# Altium schematic sheet micro.SchDoc
size A4
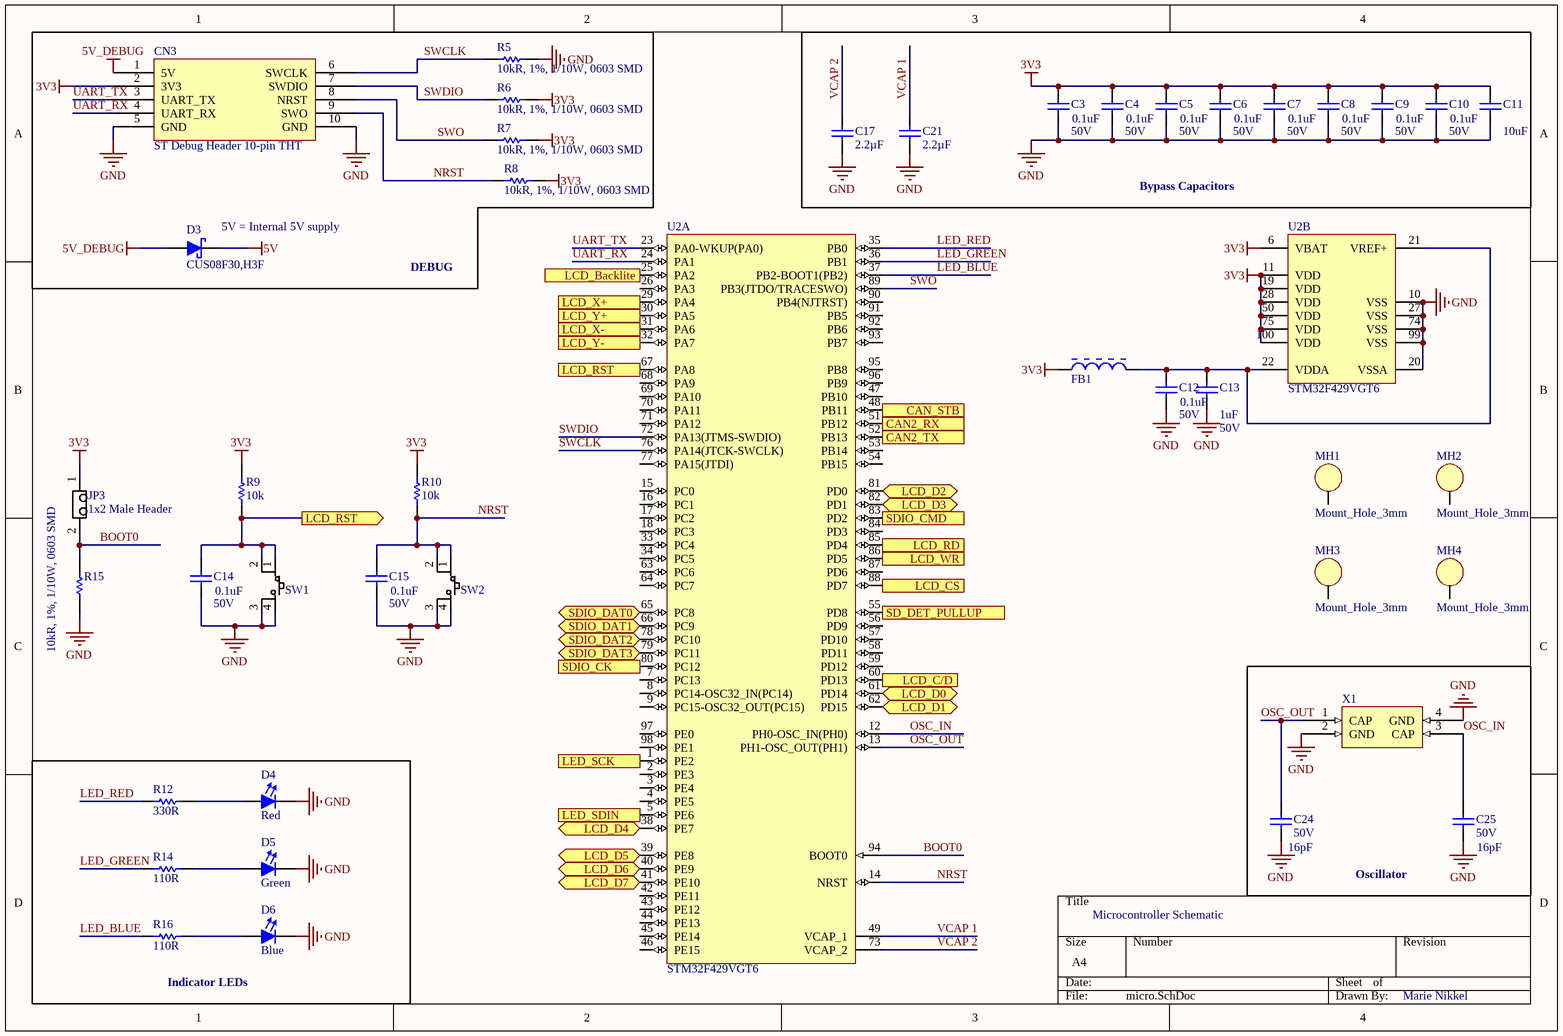
[diagram p0: micro.SchDoc]

## Parts
C3  Voltage: 50V  Capacitance: 0.1uF  [FP-CL10-0_1-IPC_A]  (hidden comment: CL10B104JB8NNNC)
C4  Voltage: 50V  Capacitance: 0.1uF  [FP-CL10-0_1-IPC_A]  (hidden comment: CL10B104JB8NNNC)
C5  Voltage: 50V  Capacitance: 0.1uF  [FP-CL10-0_1-IPC_A]  (hidden comment: CL10B104JB8NNNC)
C6  Voltage: 50V  Capacitance: 0.1uF  [FP-CL10-0_1-IPC_A]  (hidden comment: CL10B104JB8NNNC)
C7  Voltage: 50V  Capacitance: 0.1uF  [FP-CL10-0_1-IPC_A]  (hidden comment: CL10B104JB8NNNC)
C8  Voltage: 50V  Capacitance: 0.1uF  [FP-CL10-0_1-IPC_A]  (hidden comment: CL10B104JB8NNNC)
C9  Voltage: 50V  Capacitance: 0.1uF  [FP-CL10-0_1-IPC_A]  (hidden comment: CL10B104JB8NNNC)
C10  Voltage: 50V  Capacitance: 0.1uF  [FP-CL10-0_1-IPC_A]  (hidden comment: CL10B104JB8NNNC)
C11  Capacitance: 10uF  [CAPC3216X180X50ML20T30]  (hidden comment: CL31B106KBHNNNE)
C12  Voltage: 50V  Capacitance: 0.1uF  [FP-CL10-0_1-IPC_A]  (hidden comment: CL10B104JB8NNNC)
C13  Capacitance: 1uF  Voltage: 50V  [0803 CAP]  (hidden comment: CL21B105KBFNNNG)
C14  Voltage: 50V  Capacitance: 0.1uF  [FP-CL10-0_1-IPC_A]  (hidden comment: CL10B104JB8NNNC)
C15  Voltage: 50V  Capacitance: 0.1uF  [FP-CL10-0_1-IPC_A]  (hidden comment: CL10B104JB8NNNC)
C17  value 2.2µF  [CAPC1608N(0603")]  (hidden comment: 2.2uF, 50V, 0603 SMD, X5R, Ceramic)
C21  value 2.2µF  [CAPC1608N(0603")]  (hidden comment: 2.2uF, 50V, 0603 SMD, X5R, Ceramic)
C24  Voltage: 50V  Capacitance: 16pF  [CAPC1608X90X35ML10T15]  (hidden comment: 16pF Ceramic 50V 5% 0603)
C25  Voltage: 50V  Capacitance: 16pF  [CAPC1608X90X35ML10T15]  (hidden comment: 16pF Ceramic 50V 5% 0603)
CN3  ST Debug Header 10-pin THT  [10-pin shrouded header THT]
D3  CUS08F30,H3F  [SC-76]
D4  Color: Red  [FP-LB_Q39E-MFG]  (hidden comment: LSQ976-NR-1)
D5  Color: Green  [FP-LB_Q39E-MFG]  (hidden comment: LT Q39G-Q1OO-25-1)
D6  Color: Blue  [FP-LB_Q39E-MFG]  (hidden comment: LBQ39E-N1OO-35-1)
FB1  BLM18AG601SN1D  [MURA-BLM18-F-H1-CHIP-2_V]  (value not drawn)
JP3  1x2 Male Header  [2X1 Males Header]
MH1  Mount_Hole_3mm  [Mount-Hole_3mm]
MH2  Mount_Hole_3mm  [Mount-Hole_3mm]
MH3  Mount_Hole_3mm  [Mount-Hole_3mm]
MH4  Mount_Hole_3mm  [Mount-Hole_3mm]
R5  10kR, 1%, 1/10W, 0603 SMD  [RESC1608N(0603")]
R6  10kR, 1%, 1/10W, 0603 SMD  [RESC1608N(0603")]
R7  10kR, 1%, 1/10W, 0603 SMD  [RESC1608N(0603")]
R8  10kR, 1%, 1/10W, 0603 SMD  [RESC1608N(0603")]
R9  value 10k  [RESC1608N(0603")]  (hidden comment: 10kR, 1%, 1/10W, 0603 SMD)
R10  value 10k  [RESC1608N(0603")]  (hidden comment: 10kR, 1%, 1/10W, 0603 SMD)
R12  Resistance: 330R  [FP-CRCW0603-e3-IPC_C]  (hidden comment: CRCW0603330RFKEA)
R14  Resistance: 110R  [RESC1608X55X25ML10T15]  (hidden comment: RC0603FR-07110RL)
R15  10kR, 1%, 1/10W, 0603 SMD  [RESC1608N(0603")]
R16  Resistance: 110R  [RESC1608X55X25ML10T15]  (hidden comment: RC0603FR-07110RL)
SW1  PTS645SL43SMTR92LFS  [4-SPST-NO]  (value not drawn)
SW2  PTS645SL43SMTR92LFS  [4-SPST-NO]  (value not drawn)
U2  STM32F429VGT6  [STM-LQFP100_L]  (parts A,B of 2)
X1  CRYSTAL 8.0MHZ 16PF SMD  [QFN250P750X520X140_HS-5M]  (value not drawn)

## Blocks framed on the sheet
Bypass Capacitors: C3-C11 C17 C21
Oscillator: C24 C25 X1
Indicator LEDs: D4-D6 R12 R14 R16

## Ports
CAN2_RX (in), CAN2_TX (out), CAN_STB (out), LCD_Backlite (out), LCD_C/D (out), LCD_CS (out), LCD_D0 (bidir), LCD_D1 (bidir), LCD_D2 (bidir), LCD_D3 (bidir), LCD_D4 (bidir), LCD_D5 (bidir), LCD_D6 (bidir), LCD_D7 (bidir), LCD_RD (out), LCD_RST (out), LCD_WR (out), LCD_X+ (in), LCD_X- (in), LCD_Y+ (in), LCD_Y- (in), LED_SCK (out), LED_SDIN (out), SD_DET_PULLUP (out), SDIO_CK (out), SDIO_CMD (out), SDIO_DAT0 (bidir), SDIO_DAT1 (bidir), SDIO_DAT2 (bidir), SDIO_DAT3 (bidir)

## Nets
3V3: C3.2 C4.2 C5.2 C6.2 C7.2 C8.2 C9.2 C10.2 C11.2 CN3.2(3V3) FB1.1 JP3.1 R6.2 R7.2 R8.2 R9.2 R10.2 U2.6(VBAT) U2.11(VDD) U2.19(VDD) U2.28(VDD) U2.50(VDD) U2.75(VDD) U2.100(VDD)
5V: D3.K(Cathode)
5V_DEBUG: CN3.1(5V) D3.A(Anode)
GND: C3.1 C4.1 C5.1 C6.1 C7.1 C8.1 C9.1 C10.1 C11.1 C12.1 C13.1 C14.1 C15.1 C17.1(Anode) C21.1(Anode) C24.1 C25.1 CN3.5(GND) CN3.10(GND) D4.1(Cathode) D5.1(Cathode) D6.1(Cathode) R5.2 R15.1 SW1.3 SW1.4 SW2.3 SW2.4 U2.10(VSS) U2.20(VSSA) U2.27(VSS) U2.74(VSS) U2.99(VSS) X1.2(GND) X1.4(GND)
BOOT0: JP3.2 R15.2 U2.94(BOOT0)
CAN2_RX: U2.51(PB12) ; port CAN2_RX
CAN2_TX: U2.52(PB13) ; port CAN2_TX
CAN_STB: U2.48(PB11) ; port CAN_STB
LCD_Backlite: U2.25(PA2) ; port LCD_Backlite
LCD_C/D: U2.60(PD13) ; port LCD_C/D
LCD_CS: U2.88(PD7) ; port LCD_CS
LCD_D0: U2.61(PD14) ; port LCD_D0
LCD_D1: U2.62(PD15) ; port LCD_D1
LCD_D2: U2.81(PD0) ; port LCD_D2
LCD_D3: U2.82(PD1) ; port LCD_D3
LCD_D4: U2.38(PE7) ; port LCD_D4
LCD_D5: U2.39(PE8) ; port LCD_D5
LCD_D6: U2.40(PE9) ; port LCD_D6
LCD_D7: U2.41(PE10) ; port LCD_D7
LCD_RD: U2.85(PD4) ; port LCD_RD
LCD_RST: C14.2 R9.1 SW1.1 SW1.2 U2.67(PA8) ; port LCD_RST
LCD_WR: U2.86(PD5) ; port LCD_WR
LCD_X+: U2.29(PA4) ; port LCD_X+
LCD_X-: U2.31(PA6) ; port LCD_X-
LCD_Y+: U2.30(PA5) ; port LCD_Y+
LCD_Y-: U2.32(PA7) ; port LCD_Y-
LED_BLUE: R16.1 U2.37(PB2-BOOT1(PB2))
LED_GREEN: R14.1 U2.36(PB1)
LED_RED: R12.1 U2.35(PB0)
LED_SCK: U2.1(PE2) ; port LED_SCK
LED_SDIN: U2.5(PE6) ; port LED_SDIN
NRST: C15.2 CN3.9(SWO) R8.1 R10.1 SW2.1 SW2.2 U2.14(NRST)
OSC_IN: C25.2 U2.12(PH0-OSC_IN(PH0)) X1.3(CAP)
OSC_OUT: C24.2 U2.13(PH1-OSC_OUT(PH1)) X1.1(CAP)
SD_DET_PULLUP: U2.55(PD8) ; port SD_DET_PULLUP
SDIO_CK: U2.80(PC12) ; port SDIO_CK
SDIO_CMD: U2.83(PD2) ; port SDIO_CMD
SDIO_DAT0: U2.65(PC8) ; port SDIO_DAT0
SDIO_DAT1: U2.66(PC9) ; port SDIO_DAT1
SDIO_DAT2: U2.78(PC10) ; port SDIO_DAT2
SDIO_DAT3: U2.79(PC11) ; port SDIO_DAT3
SWCLK: CN3.6(SWCLK) R5.1 U2.76(PA14(JTCK-SWCLK))
SWDIO: CN3.7(SWDIO) R6.1 U2.72(PA13(JTMS-SWDIO))
SWO: CN3.8(NRST) R7.1 U2.89(PB3(JTDO/TRACESWO))
UART_RX: CN3.4(UART_RX) U2.24(PA1)
UART_TX: CN3.3(UART_TX) U2.23(PA0-WKUP(PA0))
VCAP 1: C21.2(Cathode) U2.49(VCAP_1)
VCAP 2: C17.2(Cathode) U2.73(VCAP_2)
NetC12_2: C12.2 C13.2 FB1.2 U2.21(VREF+) U2.22(VDDA)
NetD4_2: D4.2(Anode) R12.2
NetD5_2: D5.2(Anode) R14.2
NetD6_2: D6.2(Anode) R16.2

Not connected (* = marked no-connect by the designer): MH1 1; MH2 1; MH3 1; MH4 1; U2 2(PE3) 3(PE4) 4(PE5) 7(PC13) 8(PC14-OSC32_IN(PC14)) 9(PC15-OSC32_OUT(PC15)) 15(PC0) 16(PC1) 17(PC2) 18(PC3) 26(PA3) 33(PC4) 34(PC5) 42(PE11) 43(PE12) 44(PE13) 45(PE14) 46(PE15) 47(PB10) 53(PB14) 54(PB15) 56(PD9) 57(PD10) 58(PD11) 59(PD12) 63(PC6) 64(PC7) 68(PA9) 69(PA10) 70(PA11) 71(PA12) 77(PA15(JTDI)) 84(PD3) 87(PD6) 90(PB4(NJTRST)) 91(PB5) 92(PB6) 93(PB7) 95(PB8) 96(PB9) 97(PE0) 98(PE1)

## Notes on the sheet
- (near D3) 5V = Internal 5V supply
- DEBUG
- Microcontroller Schematic
- Marie Nikkel

## Library data of the parts
C3 = CMP-00000-4: CAP CER 0.1UF 50V X7R 0603; Tolerance: 5%; Material: Ceramic; Case Code (Imperial): 0603; Mount: Surface Mount; Thickness: 0.035inch; Depth: 0.8mm; Packaging: Tape and Reel; Package Quantity: 1; Dielectric: X7R; Height: 0.8mm; Radiation Hardening: No; Max Operating Temperature: 125°C; Voltage Rating: 50V; Case/Package: 0603; Min Operating Temperature: -55°C; Case Code (Metric): 1608; Length: 1.6mm; Contact Plating: Tin; Width: 0.031inch
C4-C10 C12 C14 C15 = CMP-00000-3: CAP CER 0.1UF 50V X7R 0603; Tolerance: 5%; Material: Ceramic; Case Code (Imperial): 0603; Mount: Surface Mount; Thickness: 0.035inch; Depth: 0.8mm; Packaging: Tape and Reel; Package Quantity: 1; Dielectric: X7R; Height: 0.8mm; Radiation Hardening: No; Max Operating Temperature: 125°C; Voltage Rating: 50V; Case/Package: 0603; Min Operating Temperature: -55°C; Case Code (Metric): 1608; Length: 1.6mm; Contact Plating: Tin; Width: 0.031inch
C11 = CMP-00004-1: Cap Ceramic 10uF 50V X7R 10% Pad SMD 1206 125°C T/R; Thickness: 0.071inch; Case/Package: 1206; Case Code (Metric): 3216; Case Code (Imperial): 1206; Voltage Rating: 50V; Length: 0.126inch; Max Operating Temperature: 125°C; Voltage Rating (DC): 50V; Dielectric: X7R; Lead Free: Lead Free; Min Operating Temperature: -55°C; Tolerance: 10%; Mount: Surface Mount; Packaging: Tape and Reel; Width: 0.063inch
C13 = CMP-00005-3: SAMSUNG ELECTRO-MECHANICS - CL21B105KBFNNNG - MLCC CAPACITORS; Tolerance: 10%; Material: Ceramic; Dielectric: X7R; Case/Package: 0805; Voltage Rating: 50V; Contact Plating: Tin; Max Operating Temperature: 125°C; Termination: Wraparound; Package Quantity: 3000; Depth: 1.25mm; Mount: Surface Mount; Min Operating Temperature: -55°C; Thickness: 0.053inch; Packaging: Tape and Reel; Case Code (Metric): 2012; Length: 2mm; Case Code (Imperial): 0805; Width: 0.049inch
C17 C21 = CMP-006-0030-1: Capacitor, Ceramic, 50V, 10%, 0603 SMD, X5R; Date Created: *; Design Item ID: 2.2uF, 50V, 0603 SMD, X5R, Ceramic; Made By: *; Publisher: AUVic; Source: AUVic_Schematic_Library_Capacitors.SchLib; Pin Count: 2; PackageDescription: Chip Capacitor; Component Type: Standard
C24 C25 = CMP-00087-2: Cap Ceramic 16pF 50V C0G 5% SMD 0603 125C Paper T/R; Temperature Coefficient: 30ppm/°C; Termination: SMD/SMT; Voltage Rating: 50V; Dielectric: C0G; Radiation Hardening: No; Voltage Rating (DC): 50V; Max Operating Temperature: 125°C; Height: 0.8mm; Width: 0.8mm; Length: 1.6mm; Package Quantity: 1; Lead Free: Lead Free; Min Operating Temperature: -55°C; Case Code (Metric): 1608; Case/Package: 0603; Tolerance: 5%; Mount: Surface Mount; Thickness: 0.035inch; Case Code (Imperial): 0603; Depth: 0.8mm; Packaging: Tape and Reel
CN3 = CMP-00011-6: CONN HEADER VERT 10POS 2.54MM; Row Spacing: 0.1inch; Connector Type: Male Pin; Number of Positions: 10; Packaging: Tray; Package Quantity: 1; Color: Black; Number of Rows: 2; Termination: Solder; Contact Plating: Gold; Lead Free: Lead Free; Pitch: 0.1inch; Mount: Through Hole
D3 = CMP-057-0000-2: Diode Schottky 30V 800mA Surface Mount USC; Peak Non-Repetitive Surge Current: 5A; Element Configuration: Single; Peak Reverse Current: 50uA; Packaging: Tape and Reel; Mount: Surface Mount; Average Rectified Current: 800mA; Case/Package: SOD; Max Reverse Voltage (DC): 30V; Min Operating Temperature: -55°C; Contact Plating: Tin,Silver; Max Repetitive Reverse Voltage (Vrrm): 30V; Number of Pins: 2; Max Operating Temperature: 125°C
D4 = CMP-00066-2: LED Red 645nm 2-Pin Chip 0603(1608Metric) T/R; Lens Transparency: Diffused; Power Dissipation: 65mW; Forward Voltage: 2.5V; Dominant Wavelength: 633nm; Number of Elements: 1; Lens Style: Diffused,Flat,Colorless,Rectangular; Lens Color: White; Viewing Angle: 160°; Luminous Flux: 0.33lm; Test Current: 20mA; Forward Current: 25mA; Luminous Intensity: 180mcd; Reverse Voltage: 12V; Lens Size: 0.8mm; Max Operating Temperature: 85°C; Depth: 0.9mm; Illumination Color: Red; Packaging: Tape and Reel; Min Operating Temperature: -30°C; Case Code (Imperial): 0603; Case Code (Metric): 1608; Number of Pins: 2; Mount: Surface Mount; Height: 0.8mm; Package Quantity: 1; Length: 1.7mm; Width: 0.8mm; Number of LEDs: 1; Case/Package: 0603; Radiation Hardening: No
D5 = CMP-00064-3: LED GREEN DIFFUSED 0603 SMD; Dominant Wavelength: 530nm; Luminous Intensity: 280mcd; Lens Style: Diffused,Colorless,Rectangular; Number of LEDs: 1; Forward Voltage: 2.85V; Test Current: 5mA; Reverse Voltage: 5V; Forward Current: 15mA; Luminous Flux: 0.55lm; Radiation Hardening: No; Packaging: Tape and Reel; Mount: Surface Mount; Max Operating Temperature: 85°C; Number of Elements: 1; Number of Pins: 2; Min Operating Temperature: -40°C; Depth: 0.9mm; Case/Package: SMD/SMT; Length: 1.7mm
D6 = CMP-00063-3: LED BLUE DIFFUSED 0603 SMD; Luminous Flux: 0.13lm; Lens Size: 0.8mm; Lens Color: White; Viewing Angle: 130°; Luminous Intensity: 42mcd; Number of LEDs: 1; Dominant Wavelength: 470nm; Lens Style: Flat,Diffused,Colorless,Rectangular; Test Current: 5mA; Forward Voltage: 2.85V; Packaging: Tape and Reel; Case/Package: 0603; Height: 0.4mm; Number of Pins: 2; Mount: Surface Mount; Case Code (Metric): 1608; Case Code (Imperial): 0603; Lens Transparency: Diffused; Width: 0.8mm; Length: 1.6mm; Radiation Hardening: No
FB1 = CMP-00016-1: MURATA - BLM18AG601SN1D - Feritový Korálek, 0603 / 1608, 600 ohm, 500 mA, Série BLM18A, 0.38 ohm, ± 25%; DC Current: 500mA; Impedance: 600R; DC Resistance (DCR): 380mR; Core Material: Ferrite; Shielding: Unshielded; Number of Lines: 1; Test Frequency: 100MHz; Material: Steel,Ferrite; Height: 0.8mm; Depth: 0.8mm; Min Operating Temperature: -55°C; Packaging: Tape and Reel; Weight: 7.1E-05oz; Width: 0.8mm; Military Standard: Not; Max Operating Temperature: 125°C; Max Current Rating: 500mA; Case Code (Metric): 1608; Length: 1.6mm; Case Code (Imperial): 0603; Package Quantity: 1; Max DC Current: 500mA; REACH SVHC: No SVHC; Termination: SMD/SMT; Current Rating: 500mA; Lead Free: Lead Free; Tolerance: 25%; Case/Package: 0603; Number of Pins: 2; Radiation Hardening: No; Frequency: 100MHz; Number of Circuits: 1
JP3 = CMP-004-0001-1: Made By: Andy Bates; Source: AUVic_Schematic_Library_Connectors.SchLib; Pin Count: 2; Design Item ID: 1x2 Male Header; Component Type: Standard
MH1-MH4 = CMP-004-0010-4: Mounting hold for M3 hex standoff; Design Item ID: Mount_Hole_3mm; Pin Count: 1; Source: AUVic_Schematic_Library_Connectors.SchLib; Component Type: Standard
R5-R8 R15 = CMP-047-0013-1: Owned By: AUVic; Made By: Ashwin Sira; Value: 10k; Design Item ID: 10kR, 1%, 1/10W, 0603 SMD; Pin Count: 2; Component Type: Standard; Created On: 14-05-31; Last Edited: 14-05-31; Source: AUVic_Schematic_Library_Resistors.SchLib
R9 R10 = CMP-047-0013-1: Owned By: AUVic; Made By: Ashwin Sira; Design Item ID: 10kR, 1%, 1/10W, 0603 SMD; Pin Count: 2; Component Type: Standard; Created On: 14-05-31; Last Edited: 14-05-31; Source: AUVic_Schematic_Library_Resistors.SchLib
R12 = CMP-00067-2: Res Thick Film 0603 330 Ohm 1% 0.1W(1/10W) +/-100ppm/ßC Pad SMD Automotive T/R; Voltage Rating (DC): 75V; Power Rating: 100mW; Temperature Coefficient: 100ppm/°C; Contact Plating: Tin; Package Quantity: 10; Tolerance: 1%; Packaging: Tape and Reel; Case/Package: 0603; Max Operating Temperature: 155°C; Case Code (Metric): 1608; Case Code (Imperial): 0603; Min Operating Temperature: -55°C; Length: 1.55mm; Height: 0.45mm; Lead Free: Lead Free; Termination: SMD/SMT; Voltage Rating: 75V; Composition: Thick Film; Weight: 7.1E-05oz; Military Standard: Not; Max Power Dissipation: 100mW; REACH SVHC: Unknown; Mount: Surface Mount; Depth: 0.85mm; Features: Automotive AEC-Q200; Number of Terminations: 2; Radiation Hardening: No; Width: 0.033inch
R14 R16 = CMP-00069-1: RES SMD 110 OHM 1% 1/10W 0603; Max Power Dissipation: 100mW; Voltage Rating (DC): 50V; Temperature Coefficient: 100ppm/°C; Working Voltage: 75V; Military Standard: Not; Termination: SMD/SMT; Number of Terminations: 2; Features: Moisture Resistant; Min Operating Temperature: -55°C; Power Rating: 100mW; Height: 0.022inch; Package Quantity: 1; Lead Free: Lead Free; Tolerance: 1%; Voltage Rating: 50V; Composition: Thick Film; Case Code (Imperial): 0603; Length: 1.6mm; Packaging: Tape and Reel; Case Code (Metric): 1608; Max Operating Temperature: 155°C; Depth: 0.8mm; Case/Package: 0603; Width: 0.031inch
SW1 SW2 = CMP-00077-1: Black Switch Tactile N.O. SPST Round Button Gull Wing 0.05A 12VDC 100000Cycles 1.27N SMD T/R; Actuator Type: Standard; Current Rating: 50mA; Switch Function: Off-Mom; Actuator Length: 0.85mm; Contact Resistance: 100mR; Max Voltage Rating (DC): 12V; Actuator Material: Nylon,Polyamide; Illumination Type: Non-Illuminated; Orientation: Straight; Mechanical Life: 100000Cycles; Package Quantity: 1000; Operating Force: 1.27N; Color: Black; Button Colour: Black; Max Operating Temperature: 60°C; Length: 6mm; Contact Plating: Silver; Termination: Gull Wing; Min Operating Temperature: -20°C; Mount: Surface Mount; Voltage Rating (DC): 12V; Max Current Rating: 50mA; Lead Free: Lead Free; Depth: 9mm; Packaging: Tape and Reel; Throw Configuration: SPST; Contact Material: Bronze,Brass,Silver
U2 = CMP-00008-1: MCU 32-bit STM32F ARM Cortex M4 RISC 1024KB Flash 2.5V/3.3V 100-Pin LQFP Tray; Number of ADC Channels: 24; Max Power Dissipation: 465mW; Number of I/Os: 82; Oscillator Type: Internal; Frequency: 180MHz; Peripherals: Brown-out Detect/Reset,POR,PWM,WDT,DMA,LCD; Data Bus Width: 32b; Number of UART Channels: 4; Interface: I2C,SPI,USB,CAN,IrDA,UART,USART,LIN,EBI/EMI,SDIO,Ethernet,I2S; Min Supply Voltage: 1.8V; Memory Size: 1MB; Number of Ethernet Channels: 1; Number of I2C Channels: 3; Number of SPI Channels: 6; Number of Timers/Counters: 14; Number of USB Channels: 2; Max Supply Voltage: 3.6V; RAM Size: 256KB; Watchdog Timer: Yes; Case/Package: LQFP; Length: 14.2mm; Number of Programmable I/O: 82; Min Operating Temperature: -40°C; REACH SVHC: No SVHC; Number of Pins: 100; Lead Free: Lead Free; Core Architecture: ARM; Radiation Hardening: No; Memory Type: FLASH; Packaging: Tray; Width: 14.2mm; Package Quantity: 540; Max Operating Temperature: 85°C; Max Frequency: 180MHz; Height: 1.45mm
X1 = CMP-00079-3: 8MHz ±30ppm Crystal 16pF 80 Ohms 4-SMD, No Lead; Frequency Stability: 50ppm; ESR (Equivalent Series Resistance): 80R; Packaging: Tape and Reel; Min Operating Temperature: -20°C; Length: 7.5mm; Case/Package: CSMD; Max Operating Temperature: 70°C; Load Capacitance: 16pF; Depth: 5.2mm; Frequency: 8MHz; Number of Pins: 4